# Altium schematic sheet POWERMANAGE.SchDoc
size A3; SheetNumber: 10; SheetTotal: 13; SPICEModelCacheCHAYJENF: <root> / <DocumentId>CHAYJENF</DocumentId> / <CacheFrame Number="0"> / <Model Name="emk105bj105_v-f" Kind="CKT"> / <Text>* EMK105BJ105_V-F     SPICE MODEL  ( General Type ) / *-------------------------------------------------------------------------------------------------------- / * Model Generated by TAIYO YUDEN Corporation (http://www.ty-top.com) / * Version 1.0 / * TAIYO YUDEN Control No. 170508_130520 / * Copyright(c) 2012 TAIYO YUDEN CO.,LTD. All Rights Reserved. / *-------------------------------------------------------------------------------------------------------- / * / * Products Name : Multilayer Ceramic Capacitors / * / * Characteristics : / *     Capacitance : 1 uF , Rated Voltage : 16V , TCC : X5R / *     Case Size : 1.0 x 0.5 / 0.039 x 0.02 [mm/inch] , Thickness : 0.5 / 0.02 [mm/inch] / *     (Conditions: Temperature = 25 degC , DC Bias Current/Voltage = 0A / 0V) / * / * Frequency Range : 40Hz - 3GHz / * / * External Node Assignments : / * / *  1  o---| |---o  2 / * / *-------------------------------------------------------------------------------------------------------- / .SubCkt EMK105BJ105_V-F 1 2 / **************************** / C0 1 110 0.68309u / Cm 1 101 0.26053u / C1 101 102 0.94076u / Rc1 101 102 1.9029k / C2 102 103 0.66707u / Rc2 102 103 120.36 / C3 103 110 0.57203u / Rc3 103 110 2.1097 / C2m 1 301 0.1871u / C21 301 302 3.2494u / Rc21 301 302 1.1117k / C22 302 303 2.1014u / Rc22 302 303 1.484k / C23 303 304 2.1172u / Rc23 303 304 1.3876k / C24 304 305 0.75729u / Rc24 304 305 332.59 / C25 305 306 0.94401u / Rc25 305 306 249.09 / C26 306 307 0.34674u / Rc26 306 307 28.352 / C27 307 308 0.37158u / Rc27 307 308 19.989 / C28 308 309 0.17933u / Rc28 308 309 31.748 / C29 309 110 0.016445u / Rc29 309 110 1.0592 / Rp0 1 110 100Meg / L0 110 120 0.2216n / Lm 120 130 0.1509n / L1 120 121 0.12659n / RL1 121 130 0.85161 / L2 120 122 0.15996n / RL2 122 130 0.42469 / L3 120 123 7.9543n / RL3 123 130 0.54643m / CR 120 124 0.24334u / LR 124 125 0.090738n / RR 125 130 68.076m / CL 130 140 2.7354p / LL 130 140 0.10762n / RL 130 140 50.614 / Rs 140 2 7.5416m / **************************** / .ends EMK105BJ105_V-F</Text> / </Model> / </CacheFrame> / </root>
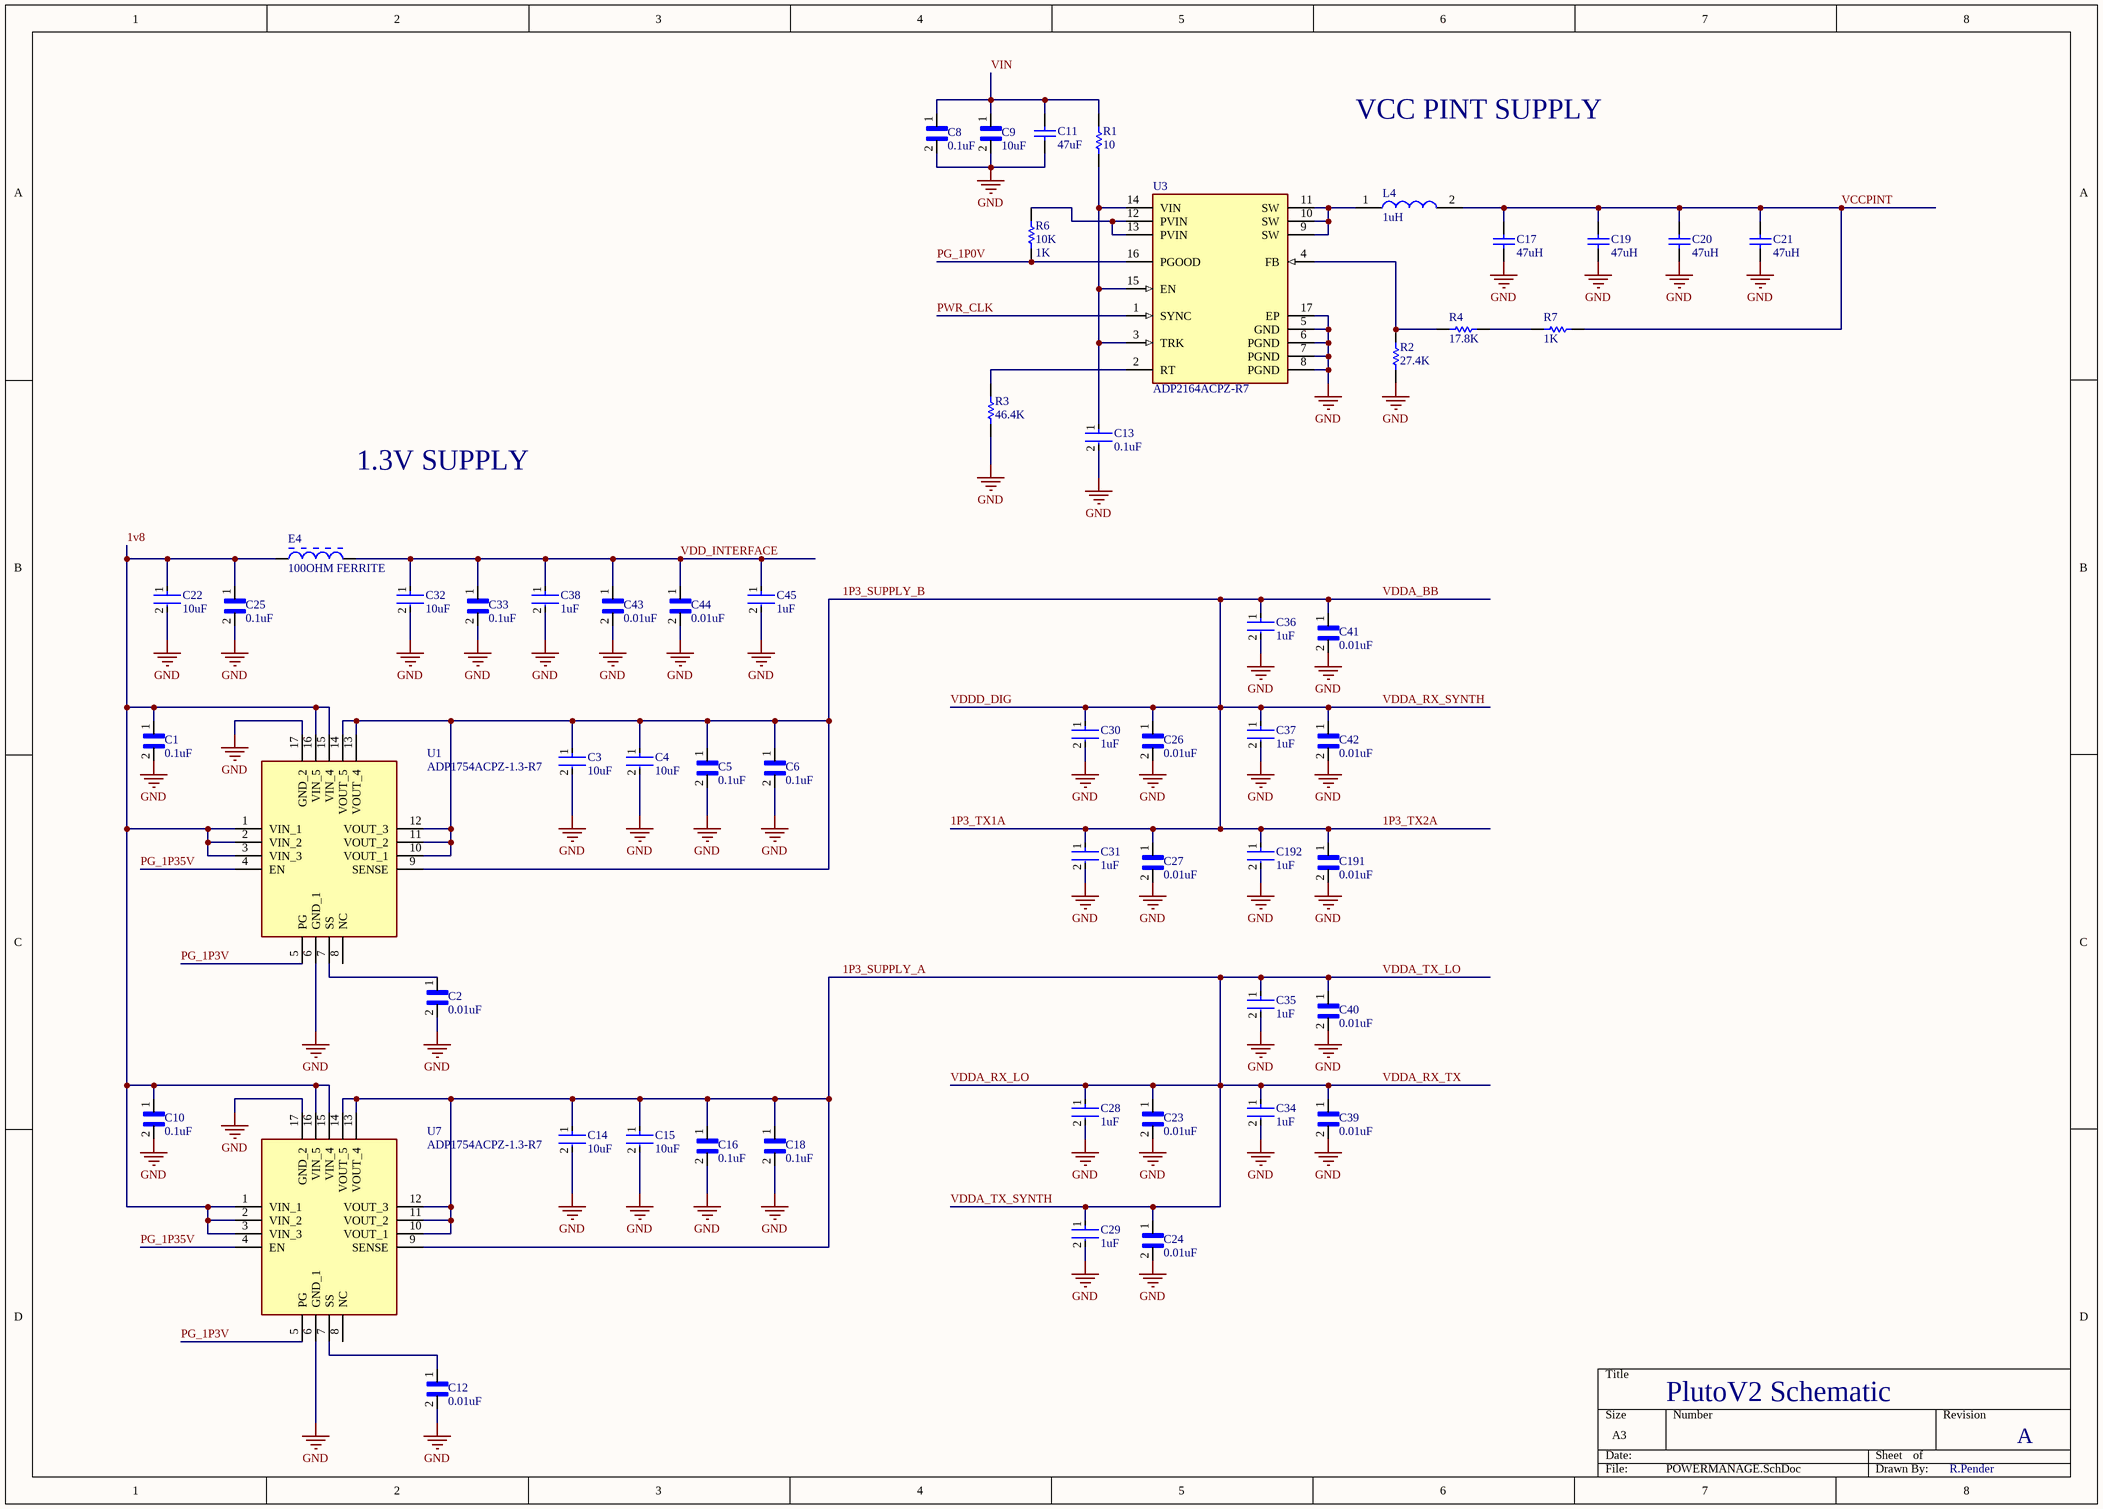
[diagram p0: POWERMANAGE.SchDoc]

## Parts
C1  0.1uF  [CAPC0603X33N]
C2  0.01uF  [CAPC0603X33N]
C3  10uF  [FP-GRM188-0_1-e0_2_0_55-IPC_C]
C4  10uF  [FP-GRM188-0_1-e0_2_0_55-IPC_C]
C5  0.1uF  [CAPC0603X33N]
C6  0.1uF  [CAPC0603X33N]
C8  0.1uF  [CAPC0603X33N]
C9  10uF  [CAPC0603X33N]
C10  0.1uF  [CAPC0603X33N]
C11  47uF  [TAYO-JMK212BBJ476MG-T_L]
C12  0.01uF  [CAPC0603X33N]
C13  0.1uF  [FP-GRM188-0_15-MFG]
C14  10uF  [FP-GRM188-0_1-e0_2_0_55-IPC_C]
C15  10uF  [FP-GRM188-0_1-e0_2_0_55-IPC_C]
C16  0.1uF  [CAPC0603X33N]
C17  47uH  [TAYO-JMK212BBJ476MG-T_L]
C18  0.1uF  [CAPC0603X33N]
C19  47uH  [TAYO-JMK212BBJ476MG-T_L]
C20  47uH  [TAYO-JMK212BBJ476MG-T_L]
C21  47uH  [TAYO-JMK212BBJ476MG-T_L]
C22  10uF  [FP-GRM188-0_1-e0_2_0_55-IPC_C]
C23  0.01uF  [CAPC0603X33N]
C24  0.01uF  [CAPC0603X33N]
C25  0.1uF  [CAPC0603X33N]
C26  0.01uF  [CAPC0603X33N]
C27  0.01uF  [CAPC0603X33N]
C28  1uF  [FP-0402-L_1_0_0_05-W_0_5-IPC_B]
C29  1uF  [FP-0402-L_1_0_0_05-W_0_5-IPC_B]
C30  1uF  [FP-0402-L_1_0_0_05-W_0_5-IPC_B]
C31  1uF  [FP-0402-L_1_0_0_05-W_0_5-IPC_B]
C32  10uF  [FP-GRM188-0_1-e0_2_0_55-IPC_C]
C33  0.1uF  [CAPC0603X33N]
C34  1uF  [FP-0402-L_1_0_0_05-W_0_5-IPC_B]
C35  1uF  [FP-0402-L_1_0_0_05-W_0_5-IPC_B]
C36  1uF  [FP-0402-L_1_0_0_05-W_0_5-IPC_B]
C37  1uF  [FP-0402-L_1_0_0_05-W_0_5-IPC_B]
C38  1uF  [FP-0402-L_1_0_0_05-W_0_5-IPC_A]
C39  0.01uF  [CAPC0603X33N]
C40  0.01uF  [CAPC0603X33N]
C41  0.01uF  [CAPC0603X33N]
C42  0.01uF  [CAPC0603X33N]
C43  0.01uF  [CAPC0603X33N]
C44  0.01uF  [CAPC0603X33N]
C45  1uF  [FP-0402-L_1_0_0_05-W_0_5-IPC_A]
C191  0.01uF  [CAPC0603X33N]
C192  1uF  [FP-0402-L_1_0_0_05-W_0_5-IPC_B]
E4  100OHM FERRITE  [TDK-MPZ2012S101A-2_V]
L4  1uH  [XFL4020102MEB]
R1  10  [RESC0603X26X15LL03T05]
R2  27.4K  [2-0402]
R3  46.4K  [1-0201]
R4  17.8K  [2-0402]
R6  10K  value 1K  [RESC1005X35N]
R7  1K  [2-0402]
U1  ADP1754ACPZ-1.3-R7  [QFN65P400X400X80-17N-D]
U3  ADP2164ACPZ-R7  [FP-CP-16-26-IPC_C]
U7  ADP1754ACPZ-1.3-R7  [QFN65P400X400X80-17N-D]

## Nets
GND: C1.2 C2.2 C3.2 C4.2 C5.2 C6.2 C8.2 C9.2 C10.2 C11.2 C12.2 C13.2 C14.2 C15.2 C16.2 C17.2 C18.2 C19.2 C20.2 C21.2 C22.2 C23.2 C24.2 C25.2 C26.2 C27.2 C28.2 C29.2 C30.2 C31.2 C32.2 C33.2 C34.2 C35.2 C36.2 C37.2 C38.2 C39.2 C40.2 C41.2 C42.2 C43.2 C44.2 C45.2 C191.2 C192.2 R2.2 R3.2 U1.6(GND_1) U1.17(GND_2) U3.5(GND) U3.6(PGND) U3.7(PGND) U3.8(PGND) U3.17(EP) U7.6(GND_1) U7.17(GND_2)
1P3_SUPPLY_A: C14.1 C15.1 C16.1 C18.1 C23.1 C24.1 C28.1 C29.1 C34.1 C35.1 C39.1 C40.1 U7.9(SENSE) U7.10(VOUT_1) U7.11(VOUT_2) U7.12(VOUT_3) U7.13(VOUT_4) U7.14(VOUT_5)  [also labelled VDDA_RX_LO, VDDA_RX_TX, VDDA_TX_LO, VDDA_TX_SYNTH]
1P3_SUPPLY_B: C3.1 C4.1 C5.1 C6.1 C26.1 C27.1 C30.1 C31.1 C36.1 C37.1 C41.1 C42.1 C191.1 C192.1 U1.9(SENSE) U1.10(VOUT_1) U1.11(VOUT_2) U1.12(VOUT_3) U1.13(VOUT_4) U1.14(VOUT_5)  [also labelled 1P3_TX1A, 1P3_TX2A, VDDA_BB, VDDA_RX_SYNTH, VDDD_DIG]
1v8: C1.1 C10.1 C22.1 C25.1 E4.1 U1.1(VIN_1) U1.2(VIN_2) U1.3(VIN_3) U1.15(VIN_4) U1.16(VIN_5) U7.1(VIN_1) U7.2(VIN_2) U7.3(VIN_3) U7.15(VIN_4) U7.16(VIN_5)
PG_1P0V: R6.1 U3.16(PGOOD)
PG_1P3V: U1.5(PG) U7.5(PG)
PG_1P35V: U1.4(EN) U7.4(EN)
PWR_CLK: U3.1(SYNC)
VCCPINT: C17.1 C19.1 C20.1 C21.1 L4.2 R7.2
VDD_INTERFACE: C32.1 C33.1 C38.1 C43.1 C44.1 C45.1 E4.2
VIN: C8.1 C9.1 C11.1 R1.2
NetC2_1: C2.1 U1.7(SS)
NetC12_1: C12.1 U7.7(SS)
NetC13_1: C13.1 R1.1 U3.3(TRK) U3.14(VIN) U3.15(EN)
NetL4_1: L4.1 U3.9(SW) U3.10(SW) U3.11(SW)
NetR2_1: R2.1 R4.1 U3.4(FB)
NetR3_1: R3.1 U3.2(RT)
NetR4_2: R4.2 R7.1
NetR6_2: R6.2 U3.12(PVIN) U3.13(PVIN)

Not connected (* = marked no-connect by the designer): U1 8(NC); U7 8(NC)

## Notes on the sheet
- VCC PINT SUPPLY
- 1.3V SUPPLY
- PlutoV2 Schematic
- A
- R.Pender

## Library data of the parts
C1 C5 C6 C8 C10 C16 C18 C25 C33 = GRM033R61C104ME84D: CAP 0.1UF 16VDC X5R 20% SMD 0201 PAPER TAPE; Package: None; Price: None; Value: *; MP: GRM033R61C104ME84D; Availability: Unavailable
C2 C9 C12 C23 C24 C26 C27 C39-C44 C191 = GRM033R71A103KA01D: SMD Capacitor X7R(EIA) with Capacitance: 10000pF Tol. 10%. Rated Voltage: 10Vdc; MF: Murata; Package: 0603 Taiyo Yuden; MP: GRM033R71A103KA01D; Value: *; SnapEDA_Link: https://www.snapeda.com/parts/GRM033R71A103KA01D/Murata/view-part/4379446/?ref=snap; Availability: Unavailable; Price: None; Check_prices: https://www.snapeda.com/parts/GRM033R71A103KA01D/Murata/view-part/4379446/?ref=eda
C3 C4 C14 C15 C22 C32 = CMP-2006-02792-2: Chip Multilayer Ceramic Capacitors for General Purpose, 0603, 10uF, X5R, 15%, 20%, 6.3V; Packaging: Tape and Reel; Voltage Rating (DC): 6.3V; Width: 0.031inch; Termination: SMD/SMT; Dielectric: X5R; Package Quantity: 4000; Voltage Rating: 6.3V; Capacitance: 10uF; Case/Package: 0603; Min Operating Temperature: -55°C; Voltage: 6.3V; Length: 1.6mm; Thickness: 0.035inch; Lead Free: Lead Free; Depth: 0.8mm; Case Code (Imperial): 0603; Max Operating Temperature: 85°C; Material: Ceramic; Height: 0.8mm; Tolerance: 20%; Mount: Surface Mount; REACH SVHC: No SVHC; Radiation Hardening: No; Case Code (Metric): 1608
C11 C17 C19-C21 = CMP-2000-06498-1: High Value Multilayer Ceramic Capacitor, 47 uF, +/-20%, 6.3 V, -55 to 85 degC, 2-Pin SMD (0805), RoHS, Tape and Reel; Manufacturer: Taiyo Yuden; PCN Part Number: X5R,X7RDielectrics23/Jan/2008; Kits: 587-1797-KIT-ND-KITCAPCERHICAP0603&0805S; Temperature Coefficient: X5R; Tolerance: ±20%; Online Catalog: MSeries; Other Names: 587-1779-1; Capacitance: 47µF; Voltage - Rated: 6.3V; Catalog Drawings: xMKSeries_0805_1.25; Operating Temperature: -55°C~85°C; Mounting Technology: SurfaceMount; Package Reference: 0805; Features: -; Lead Spacing: -; Lead Style: -; Family: CeramicCapacitors; Size / Dimension: 0.079"Lx0.049"W(2.00mmx1.25mm); Package Description: 2-Pin SMD, Body 2.2 x 1.45 mm; Mounting Type: SurfaceMount,MLCC; Package / Case: 0805(2012Metric); Series: M; Category: Capacitors; Packaging: CutTape(CT); Datasheet Version: 10/2015; Datasheet URL: http://datasheet.octopart.com/JMK212BJ476MG-T-Taiyo-Yuden-datasheet-62109412.pdf; Manufacturer URL: http://www.t-yuden.com/; Ratings: -; Height - Seated (Max): -; Standard Package: 1; Thickness (Max): 0.053"(1.35mm); Applications: GeneralPurpose
C13 = CMP-06035-003612-1: Chip Multilayer Ceramic Capacitors for General Purpose, 0603, 10uF, X5R, 15%, 20%, 10V; Tolerance: 20%; Dielectric: X5R; Package Quantity: 4000; Width: 0.8mm; Case/Package: 0603; Thickness: 0.035inch; Capacitance: 10uF; Voltage Rating: 10V; Voltage Rating (DC): 10V; Termination: SMD/SMT; Length: 1.6mm; Lead Free: Lead Free; Mount: Surface Mount; Height: 0.8mm; Depth: 0.8mm; Packaging: Tape and Reel; Weight: 0.000222oz; Min Operating Temperature: -55°C; Case Code (Metric): 1608; Max Operating Temperature: 85°C; Case Code (Imperial): 0603; Material: Ceramic
C28-C31 C34-C38 C45 C192 = CMP-14477-000104-2: None; Tolerance: 10%; Voltage Rating: 16V; Dielectric: X5R; Packaging: Tape and Reel; Depth: 0.5mm; Mount: Surface Mount; Thickness: 0.022inch; Package Quantity: 1; Min Operating Temperature: -55°C; Series: M; Voltage Rating (DC): 16V; Termination: SMD/SMT; Case/Package: 0402; Number of Pins: 2; Case Code (Imperial): 0402; Capacitance: 1uF; Length: 1mm; Halogen Free: Halogen Free; Case Code (Metric): 1005; Width: 0.02inch; RoHS Compliant: Yes; Radiation Hardening: No; Max Operating Temperature: 85°C; Height: 0.5mm; Construction: Flat
E4 = CMP-2000-05399-1: Chip Bead for Power Line, 100 Ohm, +/- 25%, 4 A, -55 to 125 degC, 0805 (2012 Metric), RoHS, Tape and Reel; Manufacturer: TDK; Maximum DC Resistance: 20mOhms; Test Frequency: 100MHz; Impedance: 100Ohms; Case Width: 1.25mm; Case Length: 2mm; Maximum DC Current: 4A; Case Height: 0.85mm; Package Reference: MPZ2012S101A-2; RoHS: Details; Tolerance: 25%; Operating Temperature Range: -55Cto+125C; Datasheet Version: Jul-13; Dimensions: 1.25mmWx2mmLx0.85mmH; Product: FerriteChipBeads; Termination Style: SMD/SMT; Datasheet URL: http://www.farnell.com/datasheets/1750041.pdf; Factory Pack Quantity: 4000; Brand: TDK; Packaging: Reel; Package Description: 2-Pin Surface Mount Device, Body 2 x 1.25 mm; Product Category: EMIFilterBeads,Chips&Arrays; Manufacturer URL: http://www.tdk.com/; Package / Case: 0805(2012metric)
L4 = XFL4020-102MEB: Inductor; Manufacturer_Name: COILCRAFT; Datasheet Link: https://www.coilcraft.com/getmedia/50632d43-da1b-4cdb-8ab4-3029cab51df3/xfl4020.pdf; Height: 2.1mm; Manufacturer_Part_Number: XFL4020-102MEB
R1 = CMP-2004-03448-1: Manufacturer: Panasonic; Part Number: ERJ1GNF10R0C
R2 R4 R7 = ERJ2RK: Precision Thick Film Chip Resistor, 10 Ohm to 1M Ohm Range, 1% and 0.5% Tolerance, 0402 Size, 0.063 W; Published: 17-Dec-2003; LatestRevisionDate: 19-Mar-2004; LatestRevisionNote: Silkscreen size reduced.; PackageDocument: Mar-2003; PackageReference: 2-0402; Publisher: Altium Limited; Code_IPC: 1005 [0402]; ComponentLink1Description: Manufacturer Link; ComponentLink1URL: http://www.panasonic.com/industrial/components/resistive_products.htm; ComponentLink2Description: Datasheet; ComponentLink2URL: http://www.panasonic.com/industrial/components/pdf/AOA0000CE2.pdf
R3 = ERJ1GE: Thick Film Chip Resistor, 10 Ohm to 1M Ohm Range, 5% Tolerance, 0201 Size, 0.05 W; Note: If flow soldering, adjust pad width of PCB Footprint to 0.7 - 0.8 times the width of the resistor.; Published: 17-Dec-2003; LatestRevisionDate: 19-Mar-2004; LatestRevisionNote: Silkscreen size reduced.; PackageDocument: Mar-2003; PackageReference: 1-0201; Publisher: Altium Limited; ComponentLink1Description: Manufacturer Link; ComponentLink1URL: http://www.panasonic.com/industrial/components/resistive_products.htm; ComponentLink2Description: Datasheet; ComponentLink2URL: http://www.panasonic.com/industrial/components/pdf/AOA0000CE1.pdf
R6 = Res1: Resistor; Published: 8-Jun-2000; LatestRevisionDate: 17-Jul-2002; LatestRevisionNote: Re-released for DXP Platform.; PackageReference: AXIAL-0.3; Publisher: Altium Limited; PackageDescription: Axial Device, Thru-Hole; 2 Leads; 0.3 in Pin Spacing
U1 U7 = ADP1754ACPZ-1.3-R7: Integrated Circuit; Manufacturer_Name: Analog Devices; Datasheet Link: https://www.analog.com/media/en/technical-documentation/data-sheets/ADP1754_1755.pdf; Height: 0.8mm; Manufacturer_Part_Number: ADP1754ACPZ-1.3-R7
U3 = CMP-09139-000017-1: IC REG BUCK ADJ 4A 16LFCSP; Manufacturer: Analog Devices; Standoff Height: 0.02mm; Max Junction Temp: +125°C; Description: Buck Switching Regulator IC Positive Adjustable 0.6V 1 Output 4A 16-WQFN Exposed Pad, CSP; Max Duty Cycle: 100%; Output Type: AdjustableProgrammable; Switching Frequency: 500-1400kHz; Min Supply Voltage: 2.7V; Max Supply Voltage: 6.5V; Nominal Supply Current: 895uA; Number Of Outputs: 1; Output Voltage: 0.6-6.5V; Switching Topology: Buck; Mouser Description: Dc-Dc Switching Buck Step Down Regulator, Adjustable, 2.7V-6.5Vin, 600Mv-6.5Vout, 4Aout, Lfcsp-16 Rohs Compliant: Yes; Automotive: No; Height: 0.8mm; Temperature Range Low: -40°C; ComponentLink2Description: Datasheet; Octopart: https://octopart.com/adp2164acpz-r7-analog+devices-21054168; Lead Free: Yes; ComponentLink2URL: https://www.analog.com/media/en/technical-documentation/data-sheets/ADP2164.PDF; Category: IC; Output Current: 4A; RoHS: TRUE; Ipc Land Pattern Name: QFN65P400X400X75-16; Device Class L2: Power Management ICs; Package: CP-16-26; Temperature Range High: +125°C; Device Class L1: Integrated Circuits (ICs); Manufacturer Part Number: ADP2164ACPZ-R7; Digikey Description: IC REG BUCK ADJ 4A 16LFCSP; Device Class L3: Voltage Regulators - Switching; Temperature: -40°C to +125°C